# Altium schematic sheet leds.SchDoc
size A3 portrait; SheetNumber: 2; SheetTotal: 6
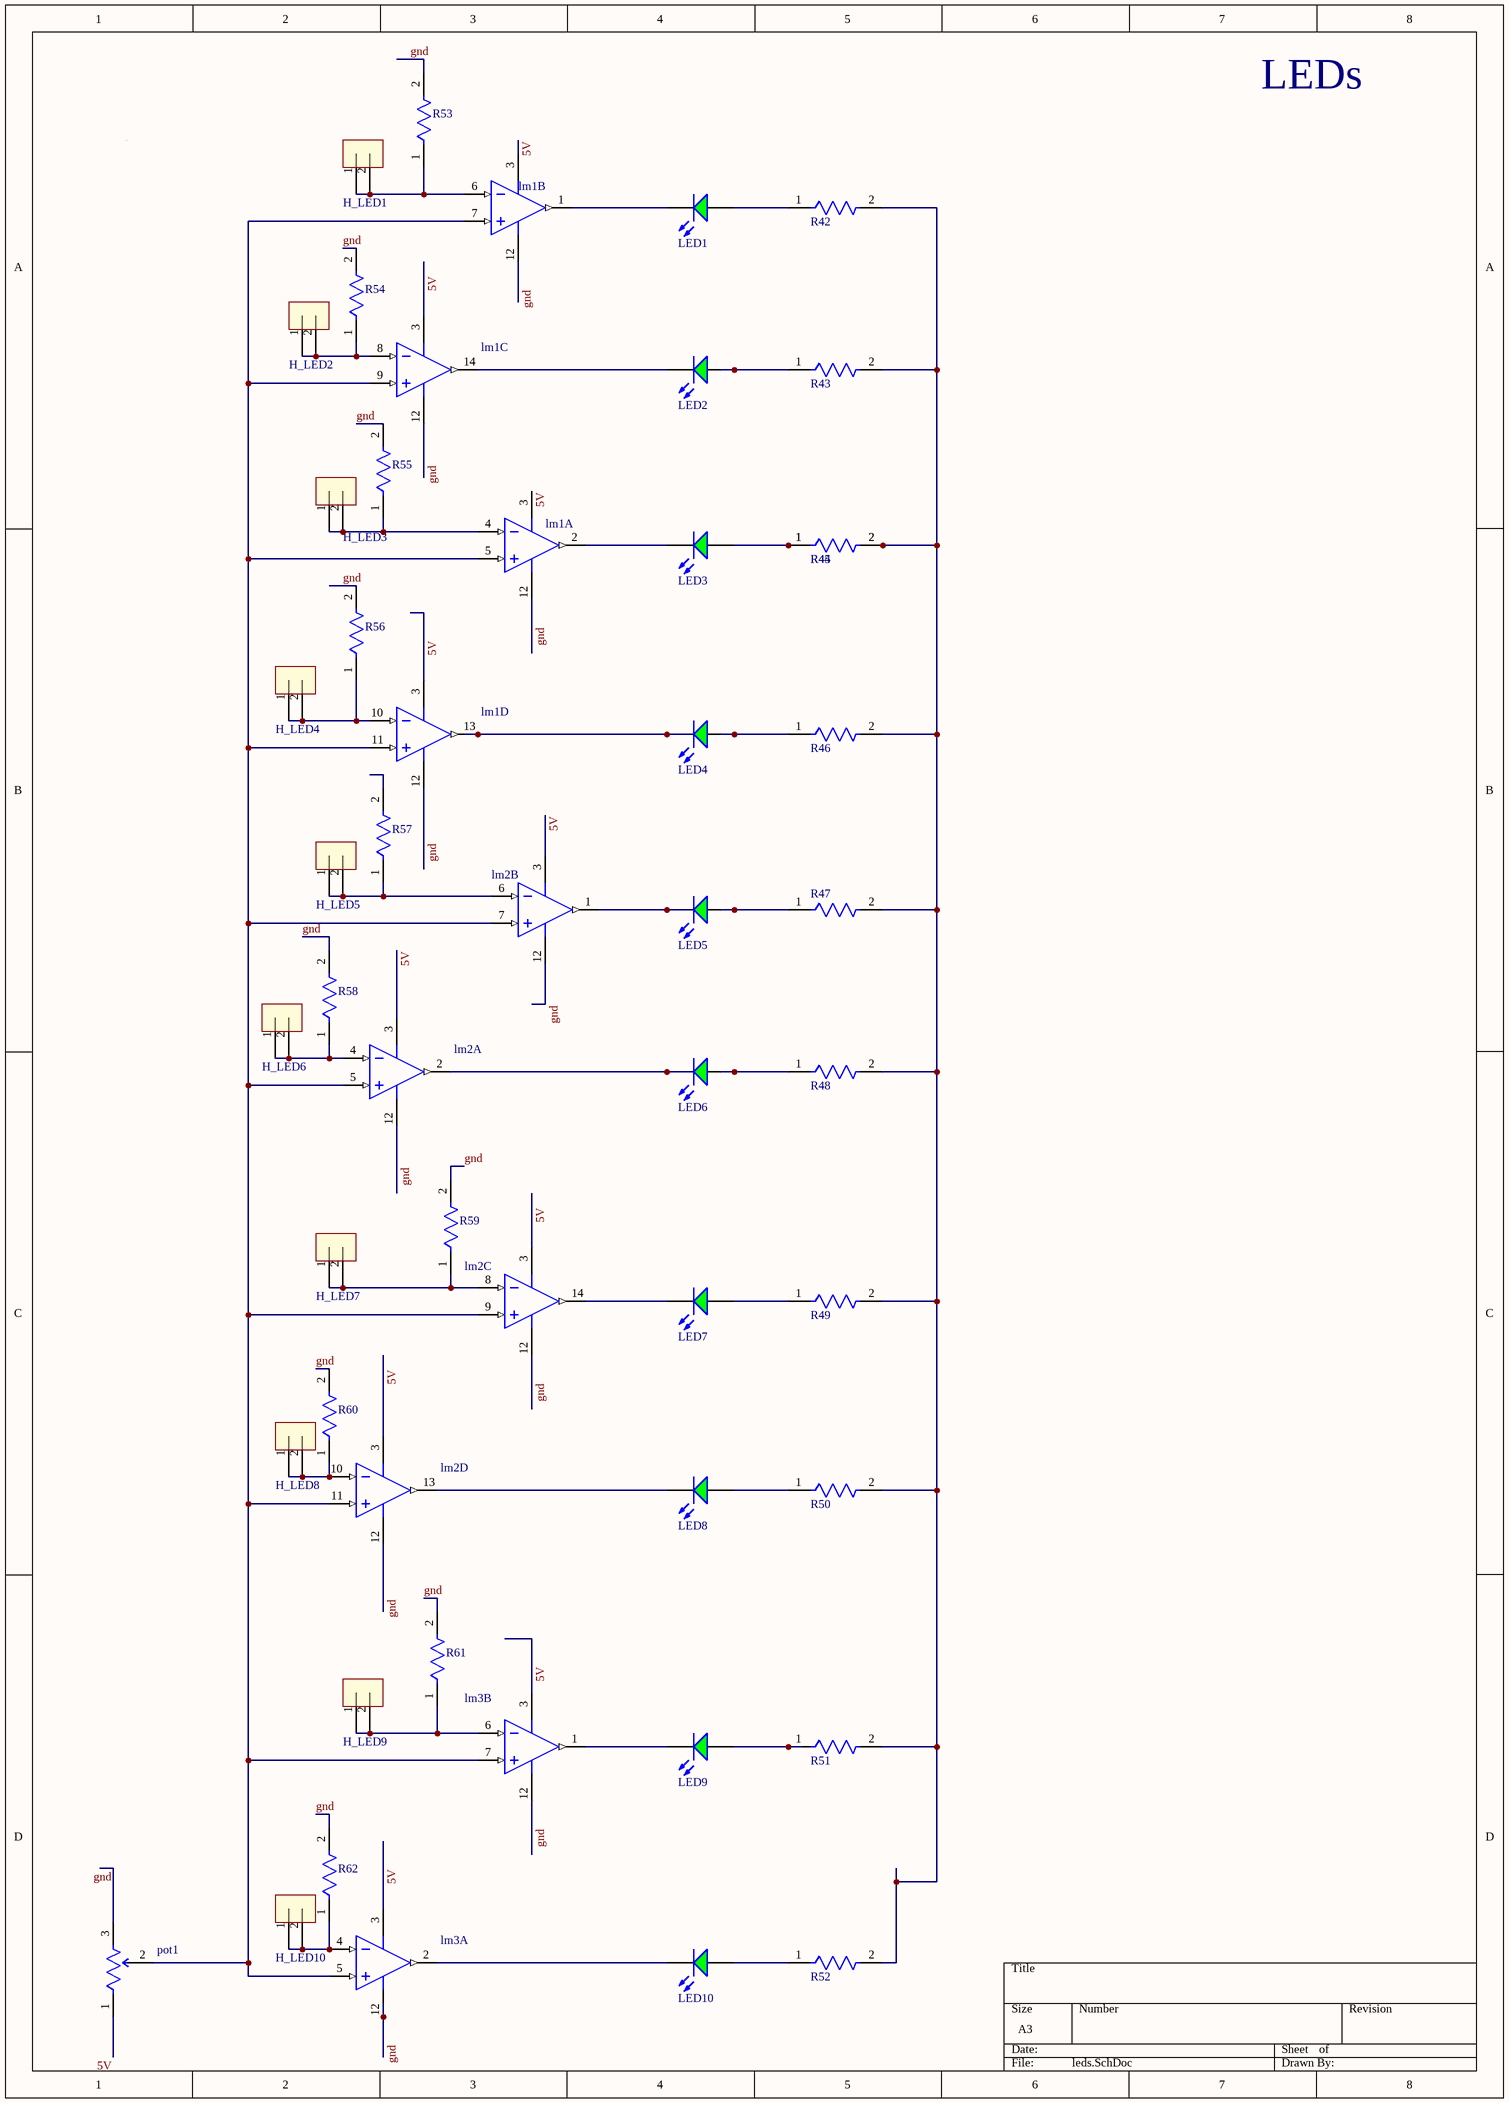
[diagram p0: leds.SchDoc]

## Parts
H_LED1  header 2x1  [header 2x1]  (value not drawn)
H_LED2  header 2x1  [header 2x1]  (value not drawn)
H_LED3  header 2x1  [header 2x1]  (value not drawn)
H_LED4  header 2x1  [header 2x1]  (value not drawn)
H_LED5  header 2x1  [header 2x1]  (value not drawn)
H_LED6  header 2x1  [header 2x1]  (value not drawn)
H_LED7  header 2x1  [header 2x1]  (value not drawn)
H_LED8  header 2x1  [header 2x1]  (value not drawn)
H_LED9  header 2x1  [header 2x1]  (value not drawn)
H_LED10  header 2x1  [header 2x1]  (value not drawn)
LED1  WP7113SGD  [KING-WP7113SGD_V]  (value not drawn)
LED2  WP7113SGD  [KING-WP7113SGD_V]  (value not drawn)
LED3  WP7113SGD  [KING-WP7113SGD_V]  (value not drawn)
LED4  WP7113SGD  [KING-WP7113SGD_V]  (value not drawn)
LED5  WP7113SGD  [KING-WP7113SGD_V]  (value not drawn)
LED6  WP7113SGD  [KING-WP7113SGD_V]  (value not drawn)
LED7  WP7113SGD  [KING-WP7113SGD_V]  (value not drawn)
LED8  WP7113SGD  [KING-WP7113SGD_V]  (value not drawn)
LED9  WP7113SGD  [KING-WP7113SGD_V]  (value not drawn)
LED10  WP7113SGD  [KING-WP7113SGD_V]  (value not drawn)
lm1  LM339J  [J0014A]  (value not drawn)  (parts A,B,C,D of 4)
lm2  LM339J  [J0014A]  (value not drawn)  (parts A,B,C,D of 4)
lm3  LM339J  [J0014A]  (value not drawn)  (parts A,B of 4)
pot1  3296W-1-501LF  [FP-3296W-MFG]  (value not drawn)
R42  MRS16000C2002FCT00  [FP-MRS1600-MFG]  (value not drawn)
R43  MRS16000C2002FCT00  [FP-MRS1600-MFG]  (value not drawn)
R44  MRS16000C2002FCT00  [FP-MRS1600-MFG]  (value not drawn)
R45  MRS16000C2002FCT00  [FP-MRS1600-MFG]  (value not drawn)
R46  MRS16000C2002FCT00  [FP-MRS1600-MFG]  (value not drawn)
R47  MRS16000C2002FCT00  [FP-MRS1600-MFG]  (value not drawn)
R48  MRS16000C2002FCT00  [FP-MRS1600-MFG]  (value not drawn)
R49  MRS16000C2002FCT00  [FP-MRS1600-MFG]  (value not drawn)
R50  MRS16000C2002FCT00  [FP-MRS1600-MFG]  (value not drawn)
R51  MRS16000C2002FCT00  [FP-MRS1600-MFG]  (value not drawn)
R52  MRS16000C2002FCT00  [FP-MRS1600-MFG]  (value not drawn)
R53  MRS16000C2002FCT00  [FP-MRS1600-MFG]  (value not drawn)
R54  MRS16000C2002FCT00  [FP-MRS1600-MFG]  (value not drawn)
R55  MRS16000C2002FCT00  [FP-MRS1600-MFG]  (value not drawn)
R56  MRS16000C2002FCT00  [FP-MRS1600-MFG]  (value not drawn)
R57  MRS16000C2002FCT00  [FP-MRS1600-MFG]  (value not drawn)
R58  MRS16000C2002FCT00  [FP-MRS1600-MFG]  (value not drawn)
R59  MRS16000C2002FCT00  [FP-MRS1600-MFG]  (value not drawn)
R60  MRS16000C2002FCT00  [FP-MRS1600-MFG]  (value not drawn)
R61  MRS16000C2002FCT00  [FP-MRS1600-MFG]  (value not drawn)
R62  MRS16000C2002FCT00  [FP-MRS1600-MFG]  (value not drawn)

## Nets
5V: lm1.3(V+) lm2.3(V+) lm3.3(V+) pot1.1(CCW)
gnd: lm1.12(GND) lm2.12(GND) lm3.12(GND) pot1.3(CW) R53.2 R54.2 R55.2 R56.2 R58.2 R59.2 R60.2 R61.2 R62.2
NetH_LED1_1: H_LED1.1 H_LED1.2 lm1.6(IN2-) R53.1
NetH_LED2_1: H_LED2.1 H_LED2.2 lm1.8(IN3-) R54.1
NetH_LED3_1: H_LED3.1 H_LED3.2 lm1.4(IN1-) R55.1
NetH_LED4_1: H_LED4.1 H_LED4.2 lm1.10(IN4-) R56.1
NetH_LED5_1: H_LED5.1 H_LED5.2 lm2.6(IN2-) R57.1
NetH_LED6_1: H_LED6.1 H_LED6.2 lm2.4(IN1-) R58.1
NetH_LED7_1: H_LED7.1 H_LED7.2 lm2.8(IN3-) R59.1
NetH_LED8_1: H_LED8.1 H_LED8.2 lm2.10(IN4-) R60.1
NetH_LED9_1: H_LED9.1 H_LED9.2 lm3.6(IN2-) R61.1
NetH_LED10_1: H_LED10.1 H_LED10.2 lm3.4(IN1-) R62.1
NetLED1_1: LED1.1(A) R42.1
NetLED1_2: LED1.2(K) lm1.1(OUT2)
NetLED2_1: LED2.1(A) R43.1
NetLED2_2: LED2.2(K) lm1.14(OUT3)
NetLED3_1: LED3.1(A) R44.1 R45.1
NetLED3_2: LED3.2(K) lm1.2(OUT1)
NetLED4_1: LED4.1(A) R46.1
NetLED4_2: LED4.2(K) lm1.13(OUT4)
NetLED5_1: LED5.1(A) R47.1
NetLED5_2: LED5.2(K) lm2.1(OUT2)
NetLED6_1: LED6.1(A) R48.1
NetLED6_2: LED6.2(K) lm2.2(OUT1)
NetLED7_1: LED7.1(A) R49.1
NetLED7_2: LED7.2(K) lm2.14(OUT3)
NetLED8_1: LED8.1(A) R50.1
NetLED8_2: LED8.2(K) lm2.13(OUT4)
NetLED9_1: LED9.1(A) R51.1
NetLED9_2: LED9.2(K) lm3.1(OUT2)
NetLED10_1: LED10.1(A) R52.1
NetLED10_2: LED10.2(K) lm3.2(OUT1)
Netlm1_5: lm1.5(IN1+) lm1.7(IN2+) lm1.9(IN3+) lm1.11(IN4+) lm2.5(IN1+) lm2.7(IN2+) lm2.9(IN3+) lm2.11(IN4+) lm3.5(IN1+) lm3.7(IN2+) pot1.2(WIPER)
NetR42_2: R42.2 R43.2 R44.2 R45.2 R46.2 R47.2 R48.2 R49.2 R50.2 R51.2 R52.2

Not connected (* = marked no-connect by the designer): R57 2

## Notes on the sheet
- LEDs

## Library data of the parts
H_LED1-H_LED10 = Heade 1x2: header male 2 pin; pin to pad: 1>C1 2>C2; Parameter 1: H2x1; Parameter 2: *
LED1-LED10 = CMP-2100-03698-1: LED Green, 62.5 mW, 25 mA, -40 to 85 degC, 2-Pin THD, RoHS, Bulk; Manufacturer: Kingbright; Viewing Angle: 30degrees; Lens Style: Tinted; Test Current: 20mA; Forward Voltage: 2.2V; Wavelength: 568nm; Luminous Intensity: 40mcd; Package Reference: WP7113SGD; Colour: Green; Lead Free: LeadFree; Packaging: Bulk; RoHSCompliant: true; Package Quantity: 1000; Illumination Colour: Green; Case/Package: Radial; Datasheet URL: http://www.kingbrightusa.com/images/catalog/SPEC/WP7113SGD.pdf; Dominant Wavelength: 568nm; Datasheet Version: Rev. 6B, 01/2015; Package Description: 2-Pin Through Hole Device, Dia 5.9 mm, Body Length 8.6 mm; Height: 8.6mm
lm1-lm3 = CMP-0060-00012-3: Low Power Low Offset Voltage Quad Comparator, 14-pin CerDIP; Manufacturer: Texas Instruments; PowerWise: N; PackageTopMarking: NSUZXYYTT*LM339J; PackageDescription: Cerdip, .400 x .310in Body, 14 Lead, .300in Centers, .100in Pitch; ComponentLink1Description: Datasheet URL; PinCount: 14; PackageReference: J0014A; ComponentLink1URL: http://www.ti.com/general/docs/lit/getliterature.tsp?genericPartNumber=LM339-N&fileType=pdf; CompType: Comparator; RoHS: N
pot1 = CMP-07234-000046-1: TRIMMER 500 OHM 0.5W PC PIN TOP; Resistance: 10kR; Temperature Coefficient: 100ppm/°C; Resistance Tolerance: 10%; Number of Turns: 25; Max Power Dissipation: 500mW; Packaging: Rail/Tube; Color: Blue; Technology: CERMET; Max Operating Temperature: 125°C; RoHS Compliant: Yes; Radiation Hardening: No; Series: 3296; Military Standard: Not; Width: 9.53mm; Weight: 0.03oz; Length: 9.53mm; Package Quantity: 50; Height: 0.395inch; Min Operating Temperature: -55°C; Lead Free: Lead Free; Mount: Through Hole; Depth: 4.83mm; Termination: Pin; Taper: Linear; Contact Plating: Tin; Resistor Type: Cermet; Tolerance: 10%; REACH SVHC: No SVHC; Power Rating: 500mW
R42-R62 = CMP-02408-000019-1: RES 20K OHM 0.4W 1% AXIAL; Max Power Dissipation: 400mW; Temperature Coefficient: 50ppm/°C; Resistance: 20kR; Technology: THIN FILM; Max Operating Temperature: 155°C; Number of Terminations: 2; RoHS Compliant: Yes; Packaging: Tape and Reel; Radiation Hardening: No; Contact Plating: Tin; Military Standard: Not; Construction: Cylindrical; Diameter: 1.6mm; Tolerance: 1%; Mount: Through Hole; Power Rating: 400mW; Case/Package: Conformal; Termination: Axial; Length: 3.6mm; Min Operating Temperature: -55°C; Resistor Type: Metal Film; Series: MRS16